# Altium schematic sheet OptoIso_L2H.SchDoc
size A; SheetNumber: 8; SheetTotal: 11
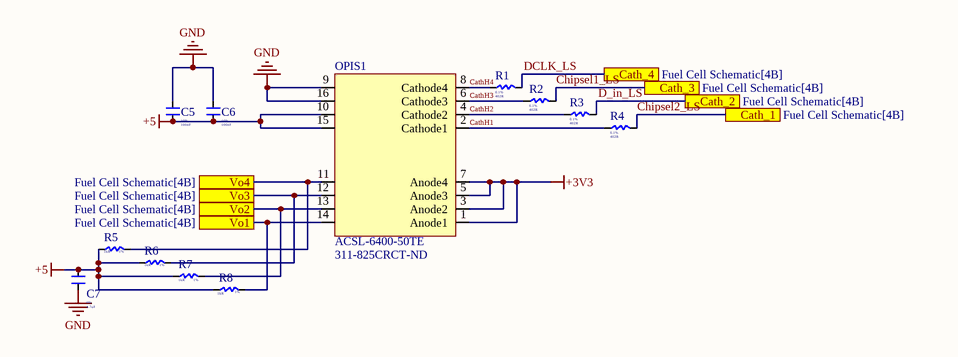
[diagram p0: OptoIso_L2H.SchDoc]

## Parts
C5  Tolerance: 10%  Capacitance: 100nF  [Capacitor_Kemet_0805]
C6  Tolerance: 10%  Capacitance: 100nF  [Capacitor_Kemet_0805]
C7  Tolerance: 5%  Capacitance: 4.7uF  [Capacitor_Kemet_0805]
OPIS1  Supplier Part Number 2: 311-825CRCT-ND  [Opto_Isolator_ACSL6400_50TE]
R1  Tolerance: 0.1%  Resistance: 402R  [LowR_Yageo]
R2  Tolerance: 0.1%  Resistance: 402R  [LowR_Yageo]
R3  Tolerance: 0.1%  Resistance: 402R  [LowR_Yageo]
R4  Tolerance: 0.1%  Resistance: 402R  [LowR_Yageo]
R5  Resistance: 1kR  Tolerance: 1%  [Resistor_YAGEO_0805]
R6  Resistance: 1kR  Tolerance: 1%  [Resistor_YAGEO_0805]
R7  Resistance: 1kR  Tolerance: 1%  [Resistor_YAGEO_0805]
R8  Resistance: 1kR  Tolerance: 1%  [Resistor_YAGEO_0805]

## Ports
Cath_1 (see Fuel Cell Schematic[4B]), Cath_2 (see Fuel Cell Schematic[4B]), Cath_3 (see Fuel Cell Schematic[4B]), Cath_4 (see Fuel Cell Schematic[4B]), Vo1 (see Fuel Cell Schematic[4B]), Vo2 (see Fuel Cell Schematic[4B]), Vo3 (see Fuel Cell Schematic[4B]), Vo4 (see Fuel Cell Schematic[4B])

## Nets
+3V3: OPIS1.1(Anode1) OPIS1.3(Anode2) OPIS1.5(Anode3) OPIS1.7(Anode4)
+5: C5.2 C6.2 C7.2 OPIS1.10(VDD) OPIS1.15(VDD) R5.1 R6.1 R7.1 R8.1
GND: C5.1 C6.1 C7.1 OPIS1.9(Ground) OPIS1.16(Ground)
CathH1: OPIS1.2(Cathode1) R4.1
CathH2: OPIS1.4(Cathode2) R3.1
CathH3: OPIS1.6(Cathode3) R2.1
CathH4: OPIS1.8(Cathode4) R1.1
Chipsel1_LS: R2.2 ; port Cath_3
Chipsel2_LS: R4.2 ; port Cath_1
D_in_LS: R3.2 ; port Cath_2
DCLK_LS: R1.2 ; port Cath_4
Vo1: OPIS1.14(Vo1) R8.2 ; port Vo1
Vo2: OPIS1.13(Vo2) R7.2 ; port Vo2
Vo3: OPIS1.12(Vo3) R6.2 ; port Vo3
Vo4: OPIS1.11(Vo4) R5.2 ; port Vo4

## Library data of the parts
C5 C6 = C0805C104K6RACTU: Cap Ceramic 0.1uF 35V X7R 10% SMD 0805 125°C Paper T/R; Manufacturer: KEMET; Supplier 1: Digi-Key; Manufacturer Part Number: C0805C104K6RACTU; RoHS: Yes; Category: Ceramic Capacitors; Stock 1: 14662; Pricing 1: 1=0.44000, 10=0.30300, 50=0.21200, 100=0.18180, 500=0.13636, 1000=0.11514 (USD); Mount: Surface Mount; Case/Package: 0805; Dielectric Material: Ceramic; Min Operating Temperature: -55°C; Max Operating Temperature: 125°C; Packaging: Tape and Reel; Dielectric: X7R; Voltage Rating (DC): 35V; Construction: Flat; Length: 2mm; Height: 0.9mm; Depth: 1.25mm; Radiation Hardening: No; RoHS Compliant: Yes; ComponentLink1URL: http://www.kemet.com/kemet/web/homepage/kechome.nsf/weben/C4DA2DA1D1C9D3C3CA2570A50016092D/$file/KEM_C1002_X7R_SMD.pdf?src-supplier=Avnet; ComponentLink1Description: http://www.kemet.com/kemet/web/homepage/kechome.nsf/weben/C4DA2DA1D1C9D3C3CA2570A50016092D/$file/KEM_C1002_X7R_SMD.pdf?src-supplier=Avnet; ComponentLink2URL: https://api.kemet.com/component-edge/download/datasheet/C0805C104K6RAC7800.pdf?src-supplier=Digi-Key; ComponentLink2Description: https://api.kemet.com/component-edge/download/datasheet/C0805C104K6RAC7800.pdf?src-supplier=Digi-Key; Supplier Part Number 1: 399-17618-1-ND
C7 = C0805C475J4RACAUTO: CAP CER 4.7UF 16V X7R 0805; Manufacturer: KEMET; Supplier 1: Digi-Key; RoHS: Yes; Category: Ceramic Capacitors; Stock 1: 16673; Pricing 1: 1=0.56000, 10=0.39300, 50=0.29680, 100=0.25850, 500=0.19150, 1000=0.16277 (USD); Mount: Surface Mount; Case/Package: 0805; Min Operating Temperature: -55°C; Max Operating Temperature: 125°C; Packaging: Tape and Reel; Voltage Rating: 16V; Ratings: AEC-Q200; RoHS Compliant: Yes; ComponentLink1URL: http://www.farnell.com/datasheets/2741387.pdf?src-supplier=Farnell; ComponentLink1Description: http://www.farnell.com/datasheets/2741387.pdf?src-supplier=Farnell; ComponentLink2URL: https://api.kemet.com/component-edge/download/datasheet/C0805C475J4RACAUTO.pdf?src-supplier=Digi-Key; ComponentLink2Description: https://api.kemet.com/component-edge/download/datasheet/C0805C475J4RACAUTO.pdf?src-supplier=Digi-Key; ComponentLink3URL: http://www.farnell.com/datasheets/2741387.pdf?src-supplier=Newark; ComponentLink3Description: http://www.farnell.com/datasheets/2741387.pdf?src-supplier=Newark; Supplier Part Number 1: 399-15716-1-ND; Manufacturer Part Number: C0805C475J4RACAUTO
OPIS1 = ACSL-6400-50TE: OPTOISO 2.5KV 4CH OPEN COLL 16SO; Manufacturer: Broadcom Avago; Forward Voltage: 1.8V; Forward Current: 15mA; Output Current: 50mA; Propagation Delay: 100ns; Reverse Breakdown Voltage: 5V; Max Power Dissipation: 40mW; Rise Time: 35ns; Number of Channels: 4; Fall Time: 12ns; Power Dissipation: 65mW; Data Rate: 15Mbps; Output Voltage: 7V; Input Type: DC; Supplier 1: Digi-Key; RoHS: Yes; Category: Optocouplers; Stock 1: 12687; Pricing 1: 1=10.50000, 10=7.61700, 100=6.29380, 500=5.51204 (USD); Mount: Surface Mount; Case/Package: SOIC; Number of Pins: 16; Contact Plating: Tin,Matte; Min Operating Temperature: -40°C; Max Operating Temperature: 100°C; Packaging: Tape and Reel; Max Output Current: 50mA; Package Quantity: 1000; Output Current per Channel: 50mA; Number of Elements: 4; Turn-On Delay Time: 100ns; Isolation Voltage: 2.5kV; Input Current: 15mA; Series: -; Radiation Hardening: No; REACH SVHC: No SVHC; Lead Free: Lead Free; RoHS Compliant: Yes; ComponentLink1URL: http://components.arrow.com/part/dataview/41316762S9676761N7786?src-supplier=Arrow+Electronics; ComponentLink1Description: http://components.arrow.com/part/dataview/41316762S9676761N7786?src-supplier=Arrow+Electronics; ComponentLink2URL: http://www.farnell.com/datasheets/1790955.pdf?src-supplier=Farnell; ComponentLink2Description: http://www.farnell.com/datasheets/1790955.pdf?src-supplier=Farnell; ComponentLink3URL: https://www.verical.com/server-webapp/html/getDatasheet?partID=300680&src-supplier=Verical; ComponentLink3Description: https://www.verical.com/server-webapp/html/getDatasheet?partID=300680&src-supplier=Verical; ComponentLink4URL: http://www.avagotech.com/docs/AV02-0235EN?src-supplier=Avnet; ComponentLink4Description: http://www.avagotech.com/docs/AV02-0235EN?src-supplier=Avnet; ComponentLink5URL: http://www.avagotech.com/docs/AV02-0235EN?src-supplier=Digi-Key; ComponentLink5Description: http://www.avagotech.com/docs/AV02-0235EN?src-supplier=Digi-Key; ComponentLink6URL: https://docs.broadcom.com/docs/AV02-0235EN?src-supplier=Digi-Key; ComponentLink6Description: https://docs.broadcom.com/docs/AV02-0235EN?src-supplier=Digi-Key; ComponentLink7URL: http://www.farnell.com/datasheets/1790955.pdf?src-supplier=Newark; ComponentLink7Description: http://www.farnell.com/datasheets/1790955.pdf?src-supplier=Newark; ComponentLink8URL: http://www.farnell.com/datasheets/1790955.pdf?src-supplier=Element14; ComponentLink8Description: http://www.farnell.com/datasheets/1790955.pdf?src-supplier=Element14; ComponentLink9URL: http://www.avagotech.com/search/results.jsp?src=&siteCriteria=ACSL6400&src-supplier=Mouser; ComponentLink9Description: http://www.avagotech.com/search/results.jsp?src=&siteCriteria=ACSL6400&src-supplier=Mouser; Supplier Part Number 1: 516-2917-1-ND; Supplier 2: Digi-Key; Manufacturer Part Number: ACSL-6400-50TE
R1-R4 = RT0805BRD07402RL: Res Thin Film 0805 402 Ohm 0.1% 1/8W ±25ppm/°C Molded SMD Paper T/R; Manufacturer: Yageo; Voltage Rating: 150V; Power Rating: 125mW; Supplier 1: Digi-Key; Manufacturer Part Number: RT0805BRD07402RL; RoHS: Yes; Category: Chip SMD Resistors; Stock 1: 13492; Pricing 1: 1=0.38000, 10=0.27200, 100=0.10870, 1000=0.05357, 2500=0.04963 (USD); Case/Package: 0805; Case Code (Metric): 2012; Case Code (Imperial): 0805; Min Operating Temperature: -55°C; Max Operating Temperature: 125°C; Packaging: Tape and Reel; Termination: SMD/SMT; Temperature Coefficient: 25ppm/°C; Voltage Rating (DC): 150V; Series: RT; Length: 2mm; Width: 1.25mm; Height: 500um; Lead Free: Lead Free; RoHS Compliant: Yes; ComponentLink1URL: https://datasheet.ciiva.com/12706/pyu-rt-1-to-0-05-rohs-l-4-12706505.pdf?src-supplier=Mouser; ComponentLink1Description: https://datasheet.ciiva.com/12706/pyu-rt-1-to-0-05-rohs-l-4-12706505.pdf?src-supplier=Mouser; Supplier Part Number 1: YAG4897CT-ND
R5-R8 = RC0805FR-071KP: Res Thick Film 0805 1K Ohm 1% 0.125W(1/8W) ±100ppm/C Pad SMD T/R; Manufacturer: Yageo; Max Power Dissipation: 125mW; Temperature Coefficient: 100ppm/°C; Supplier 1: Digi-Key; Manufacturer Part Number: RC0805FR-071KP; RoHS: Yes; Category: Chip SMD Resistors; Stock 1: 37560; Pricing 1: 1=0.10000, 10=0.06400, 100=0.02600, 1000=0.01168, 2500=0.01014 (USD); Case/Package: 0805; Case Code (Metric): 2012; Case Code (Imperial): 0805; Min Operating Temperature: -55°C; Max Operating Temperature: 155°C; Packaging: Tape and Reel; Resistor Type: Thick Film; Number of Terminations: 2; Features: Moisture Resistant; Length: 0.079inch; Width: 0.049inch; Height: 0.024inch; RoHS Compliant: Yes; ComponentLink1URL: http://www.yageo.com/NewPortal/yageodocoutput?fileName=/pdf/R-Chip/PYu-RC_51_RoHS_P_0.pdf&src-supplier=Digi-Key; ComponentLink1Description: http://www.yageo.com/NewPortal/yageodocoutput?fileName=/pdf/R-Chip/PYu-RC_51_RoHS_P_0.pdf&src-supplier=Digi-Key; ComponentLink2URL: http://www.yageo.com.tw/exep/pages/download/literatures/PYu-R_INT-thick_7.pdf?src-supplier=Digi-Key; ComponentLink2Description: http://www.yageo.com.tw/exep/pages/download/literatures/PYu-R_INT-thick_7.pdf?src-supplier=Digi-Key; Supplier Part Number 1: YAG1321CT-ND